# Altium schematic sheet GDK.SchDoc
size A4; SheetNumber: 1; SheetTotal: 1
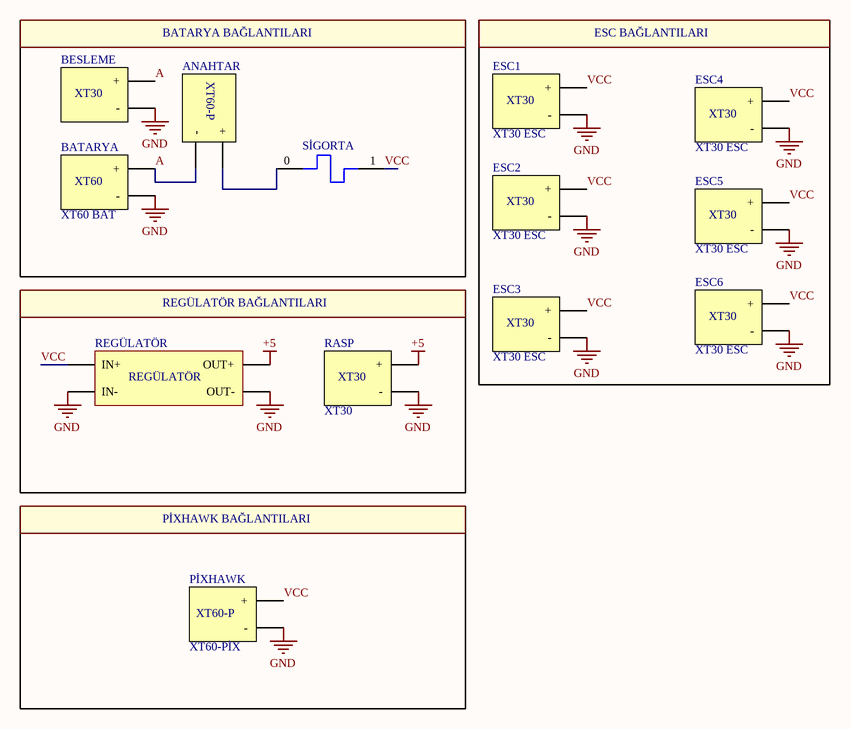
[diagram p0: GDK.SchDoc]

## Parts
ANAHTAR  ANAHTAR  [XT60 PİXHAWK]  (value not drawn)
BATARYA  XT60 BAT  [XT60 BATARYA]
BESLEME  XT30 ESC  [XT30 ESC]  (value not drawn)
ESC1  XT30 ESC  [XT30 ESC]
ESC2  XT30 ESC  [XT30 ESC]
ESC3  XT30 ESC  [XT30 ESC]
ESC4  XT30 ESC  [XT30 ESC]
ESC5  XT30 ESC  [XT30 ESC]
ESC6  XT30 ESC  [XT30 ESC]
PİXHAWK  XT60-PİX  [XT60 PİXHAWK]
RASP  XT30  [XT30 ESC]
REGÜLATÖR  REGÜLATÖR  [REGÜLATÖR]  (value not drawn)
SİGORTA  SİGORTA  [SİGORTA]  (value not drawn)

## Blocks framed on the sheet
BATARYA BAĞLANTILARI: ANAHTAR BATARYA BESLEME SİGORTA
ESC BAĞLANTILARI: ESC1-ESC6
REGÜLATÖR BAĞLANTILARI: RASP REGÜLATÖR
PİXHAWK BAĞLANTILARI: PİXHAWK

## Nets
+5: RASP.P(+) REGÜLATÖR.3(OUT+)
GND: BATARYA.2(-) BESLEME.N(-) ESC1.N(-) ESC2.N(-) ESC3.N(-) ESC4.N(-) ESC5.N(-) ESC6.N(-) PİXHAWK.2(-) RASP.N(-) REGÜLATÖR.2(IN-) REGÜLATÖR.4(OUT-)
A: ANAHTAR.2(-) BATARYA.1(+) BESLEME.P(+)
VCC: ESC1.P(+) ESC2.P(+) ESC3.P(+) ESC4.P(+) ESC5.P(+) ESC6.P(+) PİXHAWK.1(+) REGÜLATÖR.1(IN+) SİGORTA.1
NetANAHTAR_1: ANAHTAR.1(+) SİGORTA.0

## Notes on the sheet
- (in symbol XT30 ESC) XT30
- (in symbol XT60 BATARYA) XT60
- (in symbol XT60-PİX) XT60-P
- (in symbol XT60-PİXHAWK) XT60-P

## Library data of the parts
ANAHTAR = XT60-PİX
BATARYA = XT60 BATARYA
PİXHAWK = XT60-PİXHAWK